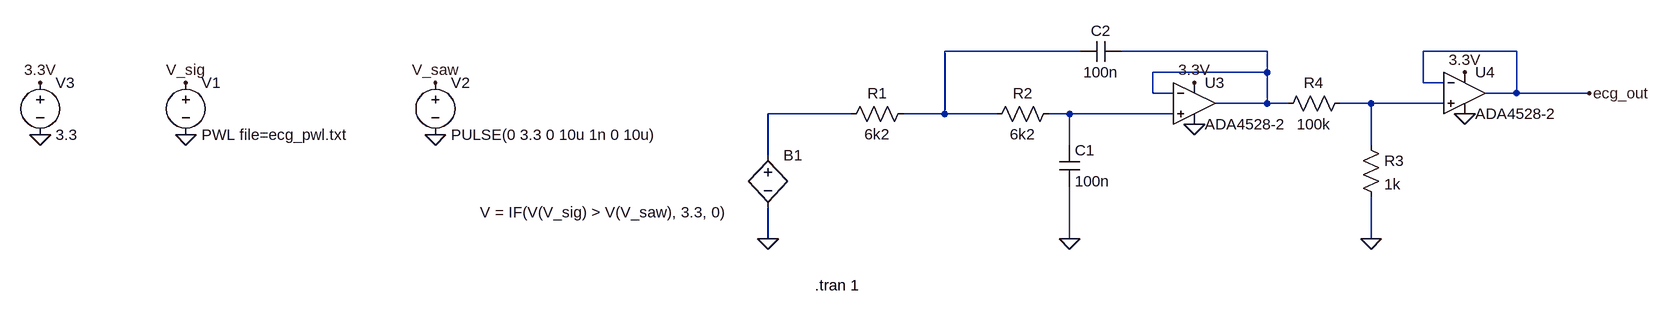
[diagram p0: schematic filter_pwm.asc]
filter_pwm.asc, the LTspice schematic file:
Version 4
SHEET 1 1408 680
WIRE 512 -96 304 -96
WIRE 800 -96 576 -96
WIRE 1184 -96 1040 -96
WIRE 800 -64 800 -96
WIRE 800 -64 624 -64
WIRE 1040 -48 1040 -96
WIRE 1072 -48 1040 -48
WIRE 624 -32 624 -64
WIRE 656 -32 624 -32
WIRE 1184 -32 1184 -96
WIRE 1184 -32 1136 -32
WIRE 1296 -32 1184 -32
WIRE 800 -16 800 -64
WIRE 800 -16 720 -16
WIRE 832 -16 800 -16
WIRE 960 -16 912 -16
WIRE 1072 -16 960 -16
WIRE 160 0 32 0
WIRE 304 0 304 -96
WIRE 304 0 240 0
WIRE 384 0 304 0
WIRE 496 0 464 0
WIRE 656 0 496 0
WIRE 496 48 496 0
WIRE 960 48 960 -16
WIRE 32 64 32 0
WIRE 32 192 32 144
WIRE 496 192 496 112
WIRE 960 192 960 128
FLAG 32 192 0
FLAG -480 32 0
FLAG -480 -48 V_saw
FLAG -864 -48 V_sig
FLAG -864 32 0
FLAG -1088 32 0
FLAG -1088 -48 3.3V
FLAG 688 -48 3.3V
FLAG 1104 -64 3.3V
FLAG 688 16 0
FLAG 1104 0 0
FLAG 496 192 0
FLAG 960 192 0
FLAG 1296 -32 ecg_out
SYMBOL voltage -864 -64 R0
WINDOW 123 0 0 Left 0
WINDOW 39 0 0 Left 0
SYMATTR InstName V1
SYMATTR Value PWL file=ecg_pwl.txt
SYMBOL res 256 -16 R90
WINDOW 0 0 56 VBottom 2
WINDOW 3 32 56 VTop 2
SYMATTR InstName R1
SYMATTR Value 6k2
SYMBOL cap 480 48 R0
SYMATTR InstName C1
SYMATTR Value 100n
SYMBOL voltage -480 -64 R0
WINDOW 123 0 0 Left 0
WINDOW 39 0 0 Left 0
SYMATTR InstName V2
SYMATTR Value PULSE(0 3.3 0 10u 1n 0 10u)
SYMBOL bv 32 48 R0
WINDOW 3 -443 103 Left 2
SYMATTR Value V = IF(V(V_sig) > V(V_saw), 3.3, 0)
SYMATTR InstName B1
SYMBOL voltage -1088 -64 R0
WINDOW 123 0 0 Left 0
WINDOW 39 0 0 Left 0
SYMATTR InstName V3
SYMATTR Value 3.3
SYMBOL res 480 -16 R90
WINDOW 0 0 56 VBottom 2
WINDOW 3 32 56 VTop 2
SYMATTR InstName R2
SYMATTR Value 6k2
SYMBOL cap 576 -112 R90
WINDOW 0 0 32 VBottom 2
WINDOW 3 32 32 VTop 2
SYMATTR InstName C2
SYMATTR Value 100n
SYMBOL res 944 32 R0
SYMATTR InstName R3
SYMATTR Value 1k
SYMBOL res 928 -32 R90
WINDOW 0 0 56 VBottom 2
WINDOW 3 32 56 VTop 2
SYMATTR InstName R4
SYMATTR Value 100k
SYMBOL Opamps\\ADA4528-2 688 -80 R0
SYMATTR InstName U3
SYMBOL Opamps\\ADA4528-2 1104 -96 R0
SYMATTR InstName U4
TEXT 104 264 Left 2 !.tran 1

The netlist it stands for:
* filter_pwm.asc
V1 V_sig 0 PWL file=ecg_pwl.txt
R1 N001 N004 6k2
C1 N005 0 100n
V2 V_saw 0 PULSE(0 3.3 0 10u 1n 0 10u)
B1 N004 0 V = IF(V(V_sig) > V(V_saw), 3.3, 0)
V3 3.3V 0 3.3
R2 N005 N001 6k2
C2 N002 N001 100n
R3 N003 0 1k
R4 N003 N002 100k
XU3 N005 N002 3.3V 0 N002 ADA4528-2  ; pins In+ In- V+ V- OUT
XU4 N003 ecg_out 3.3V 0 ecg_out ADA4528-2  ; pins In+ In- V+ V- OUT
.tran 1
.backanno
.end